# Altium schematic sheet VRAM.SchDoc
size A3
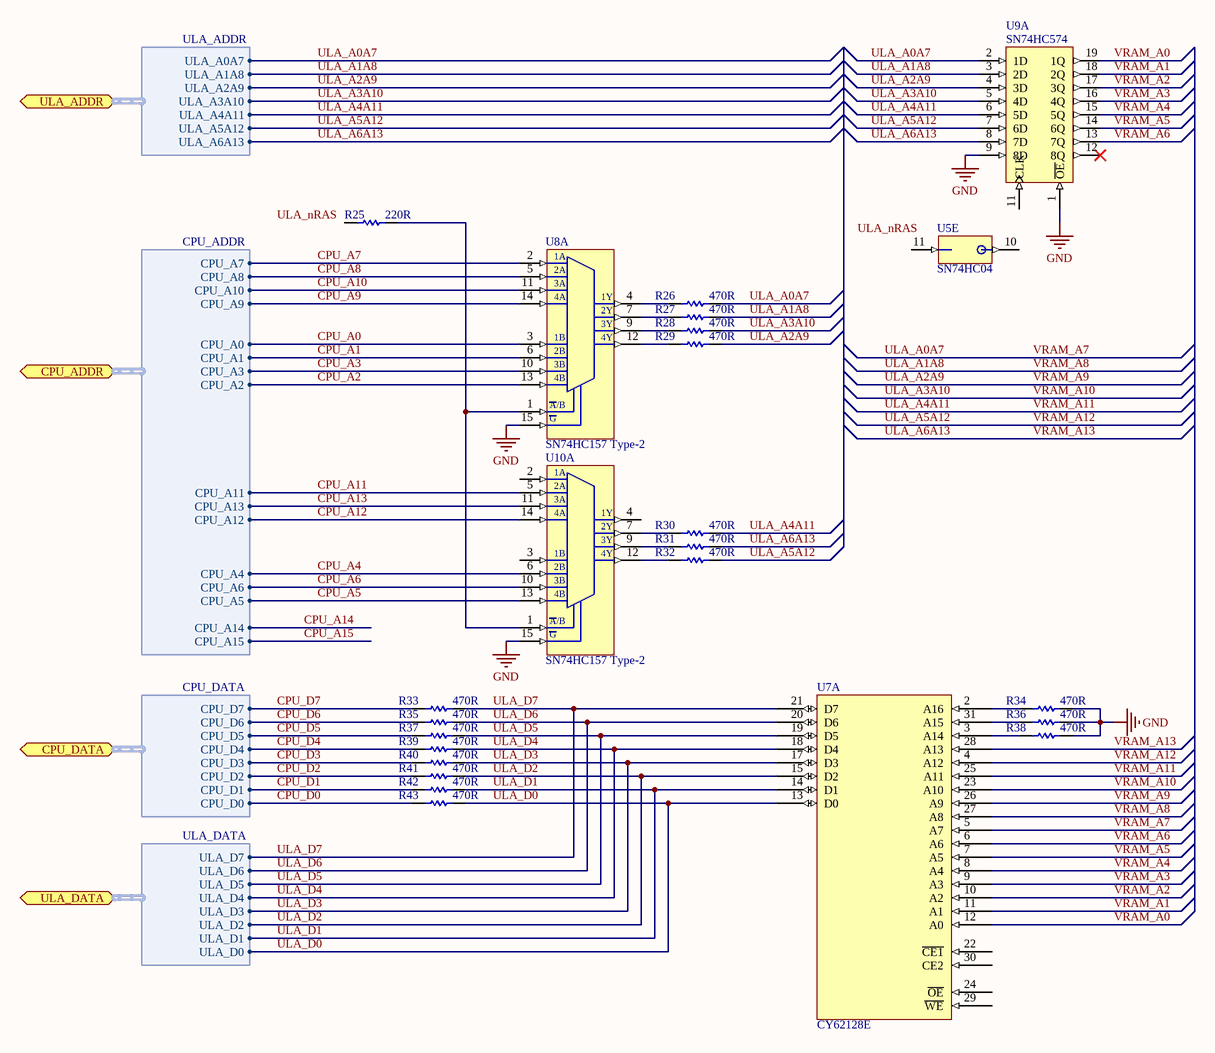
[diagram p0: VRAM.SchDoc]

## Parts
R25  220R  [0805]
R26  470R  [0805]
R27  470R  [0805]
R28  470R  [0805]
R29  470R  [0805]
R30  470R  [0805]
R31  470R  [0805]
R32  470R  [0805]
R33  470R  [0805]
R34  470R  [0805]
R35  470R  [0805]
R36  470R  [0805]
R37  470R  [0805]
R38  470R  [0805]
R39  470R  [0805]
R40  470R  [0805]
R41  470R  [0805]
R42  470R  [0805]
R43  470R  [0805]
U5  SN74HC04  [SOIC14]  (part E of 7)
U7  CY62128E  [CY62128E-SOIC]  (part A of 2)
U8  SN74HC157 Type-2  [TSSOP16]  (part A of 2)
U9  SN74HC574  [SOIC20]  (part A of 2)
U10  SN74HC157 Type-2  [TSSOP16]  (part A of 2)

## Ports
CPU_ADDR (harness CPU_ADDR), CPU_DATA (harness CPU_DATA), ULA_ADDR (harness ULA_ADDR), ULA_DATA (harness ULA_DATA)

## Harnesses
CPU_ADDR: CPU_A0, CPU_A1, CPU_A2, CPU_A3, CPU_A4, CPU_A5, CPU_A6, CPU_A7, CPU_A8, CPU_A9, CPU_A10, CPU_A11, CPU_A12, CPU_A13, CPU_A14, CPU_A15
CPU_DATA: CPU_D0, CPU_D1, CPU_D2, CPU_D3, CPU_D4, CPU_D5, CPU_D6, CPU_D7
ULA_ADDR: ULA_A0A7, ULA_A1A8, ULA_A2A9, ULA_A3A10, ULA_A4A11, ULA_A5A12, ULA_A6A13
ULA_DATA: ULA_D0, ULA_D1, ULA_D2, ULA_D3, ULA_D4, ULA_D5, ULA_D6, ULA_D7

## Nets
GND: R34.1 R36.1 R38.1 U8.15(G) U9.1(~{OE}) U9.9(8D) U10.15(G)
CPU_A0: U8.3(1B) ; port CPU_ADDR.CPU_A0
CPU_A1: U8.6(2B) ; port CPU_ADDR.CPU_A1
CPU_A2: U8.13(4B) ; port CPU_ADDR.CPU_A2
CPU_A3: U8.10(3B) ; port CPU_ADDR.CPU_A3
CPU_A4: U10.6(2B) ; port CPU_ADDR.CPU_A4
CPU_A5: U10.13(4B) ; port CPU_ADDR.CPU_A5
CPU_A6: U10.10(3B) ; port CPU_ADDR.CPU_A6
CPU_A7: U8.2(1A) ; port CPU_ADDR.CPU_A7
CPU_A8: U8.5(2A) ; port CPU_ADDR.CPU_A8
CPU_A9: U8.14(4A) ; port CPU_ADDR.CPU_A9
CPU_A10: U8.11(3A) ; port CPU_ADDR.CPU_A10
CPU_A11: U10.5(2A) ; port CPU_ADDR.CPU_A11
CPU_A12: U10.14(4A) ; port CPU_ADDR.CPU_A12
CPU_A13: U10.11(3A) ; port CPU_ADDR.CPU_A13
CPU_A14: port CPU_ADDR.CPU_A14
CPU_A15: port CPU_ADDR.CPU_A15
CPU_D0: R43.2 ; port CPU_DATA.CPU_D0
CPU_D1: R42.2 ; port CPU_DATA.CPU_D1
CPU_D2: R41.2 ; port CPU_DATA.CPU_D2
CPU_D3: R40.2 ; port CPU_DATA.CPU_D3
CPU_D4: R39.2 ; port CPU_DATA.CPU_D4
CPU_D5: R37.2 ; port CPU_DATA.CPU_D5
CPU_D6: R35.2 ; port CPU_DATA.CPU_D6
CPU_D7: R33.2 ; port CPU_DATA.CPU_D7
ULA_A0A7: R26.1 U7.5(A7) U9.2(1D) ; port ULA_ADDR.ULA_A0A7  [also labelled VRAM_A7]
ULA_A1A8: R27.1 U7.27(A8) U9.3(2D) ; port ULA_ADDR.ULA_A1A8  [also labelled VRAM_A8]
ULA_A2A9: R29.1 U7.26(A9) U9.4(3D) ; port ULA_ADDR.ULA_A2A9  [also labelled VRAM_A9]
ULA_A3A10: R28.1 U7.23(A10) U9.5(4D) ; port ULA_ADDR.ULA_A3A10  [also labelled VRAM_A10]
ULA_A4A11: R30.1 U7.25(A11) U9.6(5D) ; port ULA_ADDR.ULA_A4A11  [also labelled VRAM_A11]
ULA_A5A12: R32.1 U7.4(A12) U9.7(6D) ; port ULA_ADDR.ULA_A5A12  [also labelled VRAM_A12]
ULA_A6A13: R31.1 U7.28(A13) U9.8(7D) ; port ULA_ADDR.ULA_A6A13  [also labelled VRAM_A13]
ULA_D0: R43.1 U7.13(D0) ; port ULA_DATA.ULA_D0
ULA_D1: R42.1 U7.14(D1) ; port ULA_DATA.ULA_D1
ULA_D2: R41.1 U7.15(D2) ; port ULA_DATA.ULA_D2
ULA_D3: R40.1 U7.17(D3) ; port ULA_DATA.ULA_D3
ULA_D4: R39.1 U7.18(D4) ; port ULA_DATA.ULA_D4
ULA_D5: R37.1 U7.19(D5) ; port ULA_DATA.ULA_D5
ULA_D6: R35.1 U7.20(D6) ; port ULA_DATA.ULA_D6
ULA_D7: R33.1 U7.21(D7) ; port ULA_DATA.ULA_D7
VRAM_A0: U7.12(A0) U9.19(1Q)
VRAM_A1: U7.11(A1) U9.18(2Q)
VRAM_A2: U7.10(A2) U9.17(3Q)
VRAM_A3: U7.9(A3) U9.16(4Q)
VRAM_A4: U7.8(A4) U9.15(5Q)
VRAM_A5: U7.7(A5) U9.14(6Q)
VRAM_A6: U7.6(A6) U9.13(7Q)
NetR25_1: R25.1 U8.1(A/B) U10.1(A/B)
NetR26_2: R26.2 U8.4(1Y)
NetR27_2: R27.2 U8.7(2Y)
NetR28_2: R28.2 U8.9(3Y)
NetR29_2: R29.2 U8.12(4Y)
NetR30_2: R30.2 U10.7(2Y)
NetR31_2: R31.2 U10.9(3Y)
NetR32_2: R32.2 U10.12(4Y)
NetR34_2: R34.2 U7.2(A16)
NetR36_2: R36.2 U7.31(A15)
NetR38_2: R38.2 U7.3(A14)

Not connected (* = marked no-connect by the designer): R25 2; U5 10(Y) 11(A); U7 22(~{CE1}) 24(~{OE}) 29(~{WE}) 30(CE2); U9 11(CLK) 12(8Q)*; U10 2(1A) 3(1B) 4(1Y)

## Notes on the sheet
- Labels drawn without touching a wire or pin: ULA_nRAS

## Library data of the parts
R25-R43 = Resistor
U5 = SN74HC04: Hex Inverters
U7 = CY62128E: 128KB Static RAM
U8 U10 = SN74HC157 Type-2: Quadruple 2-Line To 1-Line Data Selectors/Mutiplexers
U9 = SN74HC574 Type-2: Octal Edge-Triggered D-Type Flip-Flops With 3-State Outputs